# EAGLE design schematic (EAGLE 7.4.0)
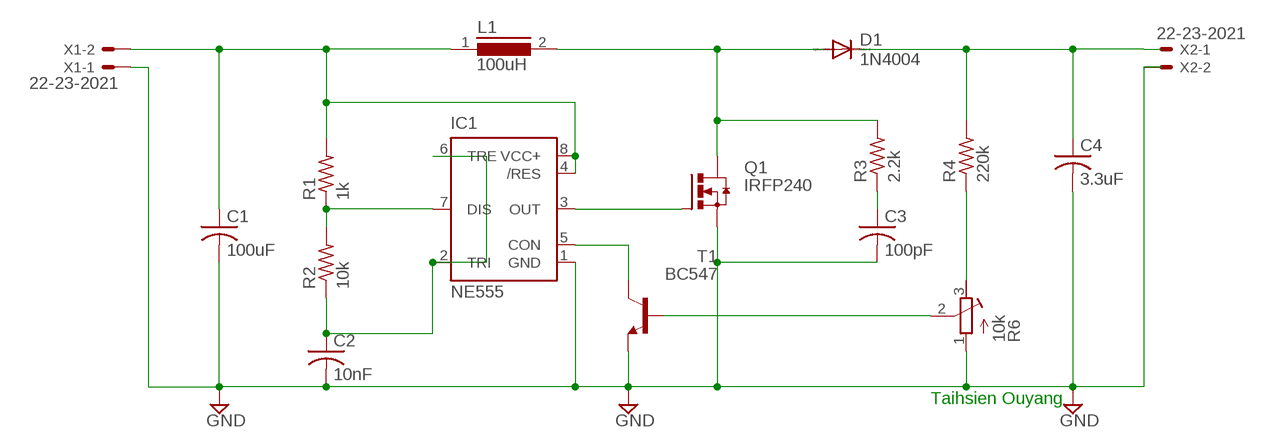
[diagram p0: schematic, sheet 1]

## Parts
C1  100uF  C-US050-025X075  [C050-025X075]
C2  10nF  C-US050-025X075  [C050-025X075]
C3  100pF  C-US050-025X075  [C050-025X075]
C4  3.3uF  C-US050-025X075  [C050-025X075]
D1  1N4004  [DO41-10]
IC1  NE555  [DIL-08]
L1  100uH  SFT1040  [SFT1040]
Q1  IRFP240  [TO247BV]
R1  1k  R-US_0207/7  [0207/7]
R2  10k  R-US_0207/7  [0207/7]
R3  2.2k  R-US_0207/7  [0207/7]
R4  220k  R-US_0207/7  [0207/7]
R6  10k  R-TRIMM3339P  [RTRIM3339P]
T1  BC547  [TO92]
X1  22-23-2021  [22-23-2021]
X2  22-23-2021  [22-23-2021]

## Nets
GND: C1.2 C2.2 C3.2 C4.2 IC1.1(GND) Q1.S R6.1(A) T1.1(E) X1.1 X2.2
N$1: IC1.7(DIS) R1.1 R2.2
N$2: C2.1 IC1.2(TRI) IC1.6(TRE) R2.1
N$5: D1.A L1.2 Q1.D R3.2
N$6: IC1.3(OUT) Q1.G
N$7: C4.1 D1.C R4.2 X2.1
N$8: R4.1 R6.3(E)
N$9: R6.2(S) T1.2(B)
N$10: C3.1 R3.1
N$13: IC1.5(CON) T1.3(C)
VCC+: C1.1 IC1.4(/RES) IC1.8(VCC+) L1.1 R1.2 X1.2

## Notes on the sheet
- Taihsien Ouyang

## Library data of the parts
C1-C4 = rcl:C-US: CAPACITOR, American symbol
D1 = diode:1N4004: DIODE general purpose rectifier, 1 A
IC1 = st-microelectronics:NE555: General purpose bipolar Timer; MF: Arrow Electronics; MPN: NE555N; OC_FARNELL: 1467742; OC_NEWARK: 89K1486
L1 = inductors:SFT1040: INDUCTOR
Q1 = transistor-power:IRFP240: HEXFET Power MosFet Source: http://www.irf.com/
R1-R4 = resistor:R-US_: RESISTOR, American symbol
R6 = resistor:R-TRIMM: Trimm resistor
T1 = transistor:BC547: NPN TRANSISTOR
X1 X2 = con-molex:22-23-2021: .100" (2.54mm) Center Header - 2 Pin; MF: MOLEX; MPN: 22-23-2021; OC_FARNELL: 1462926; OC_NEWARK: 25C3832

## Board
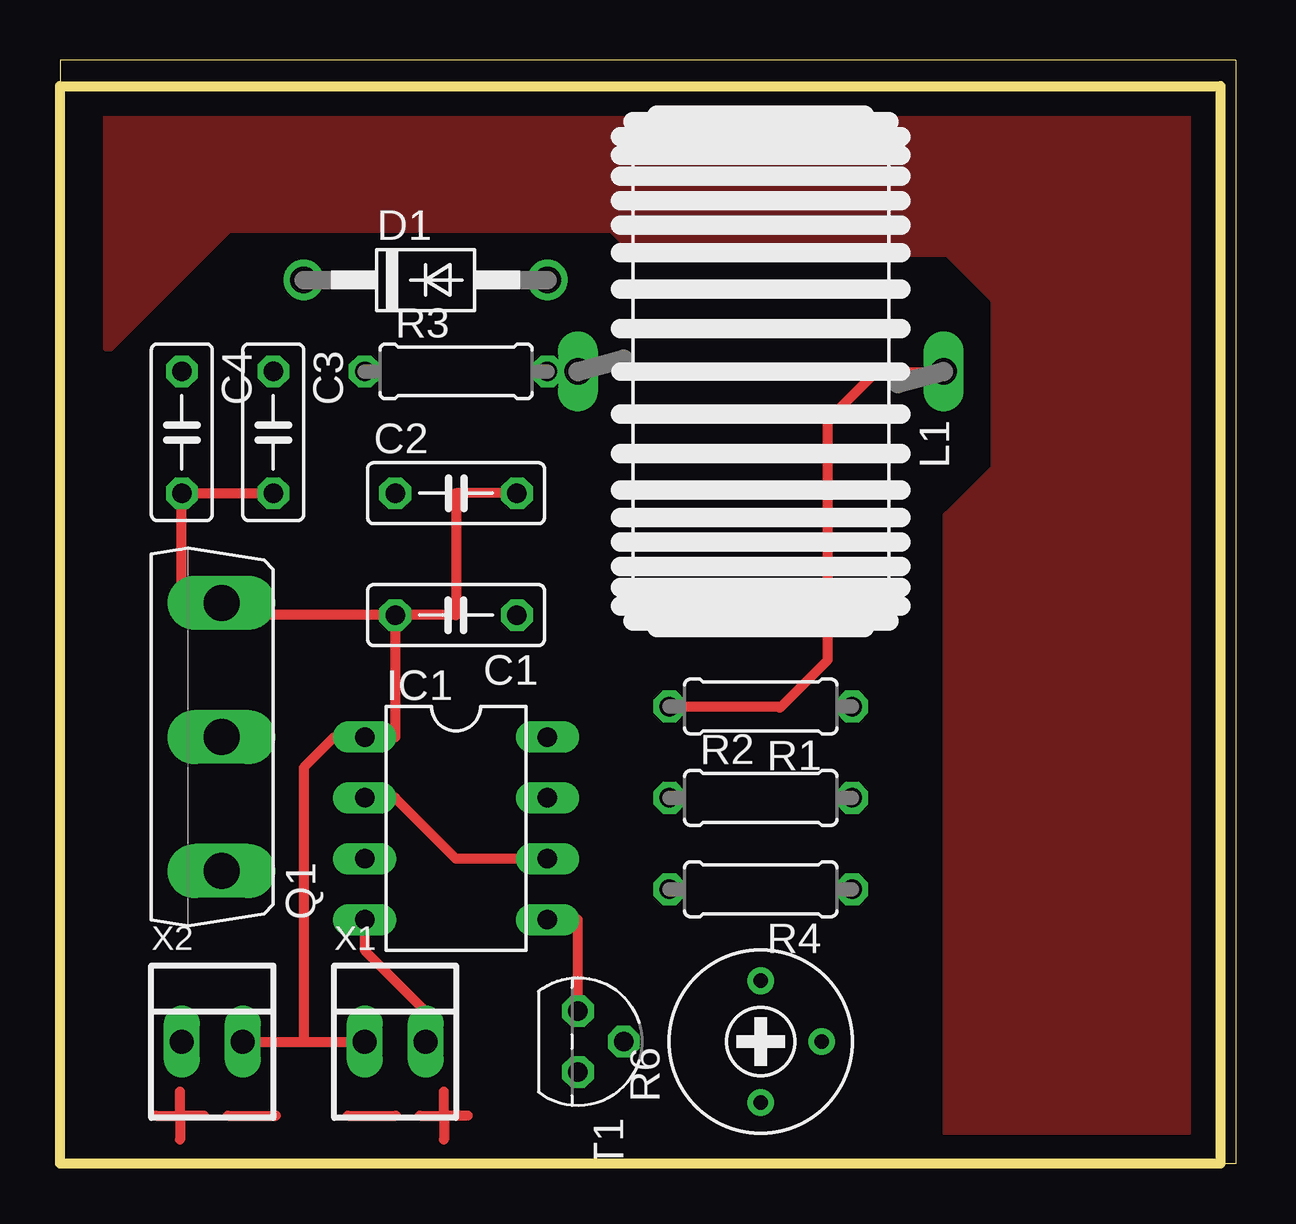
[diagram p1: board, top side]
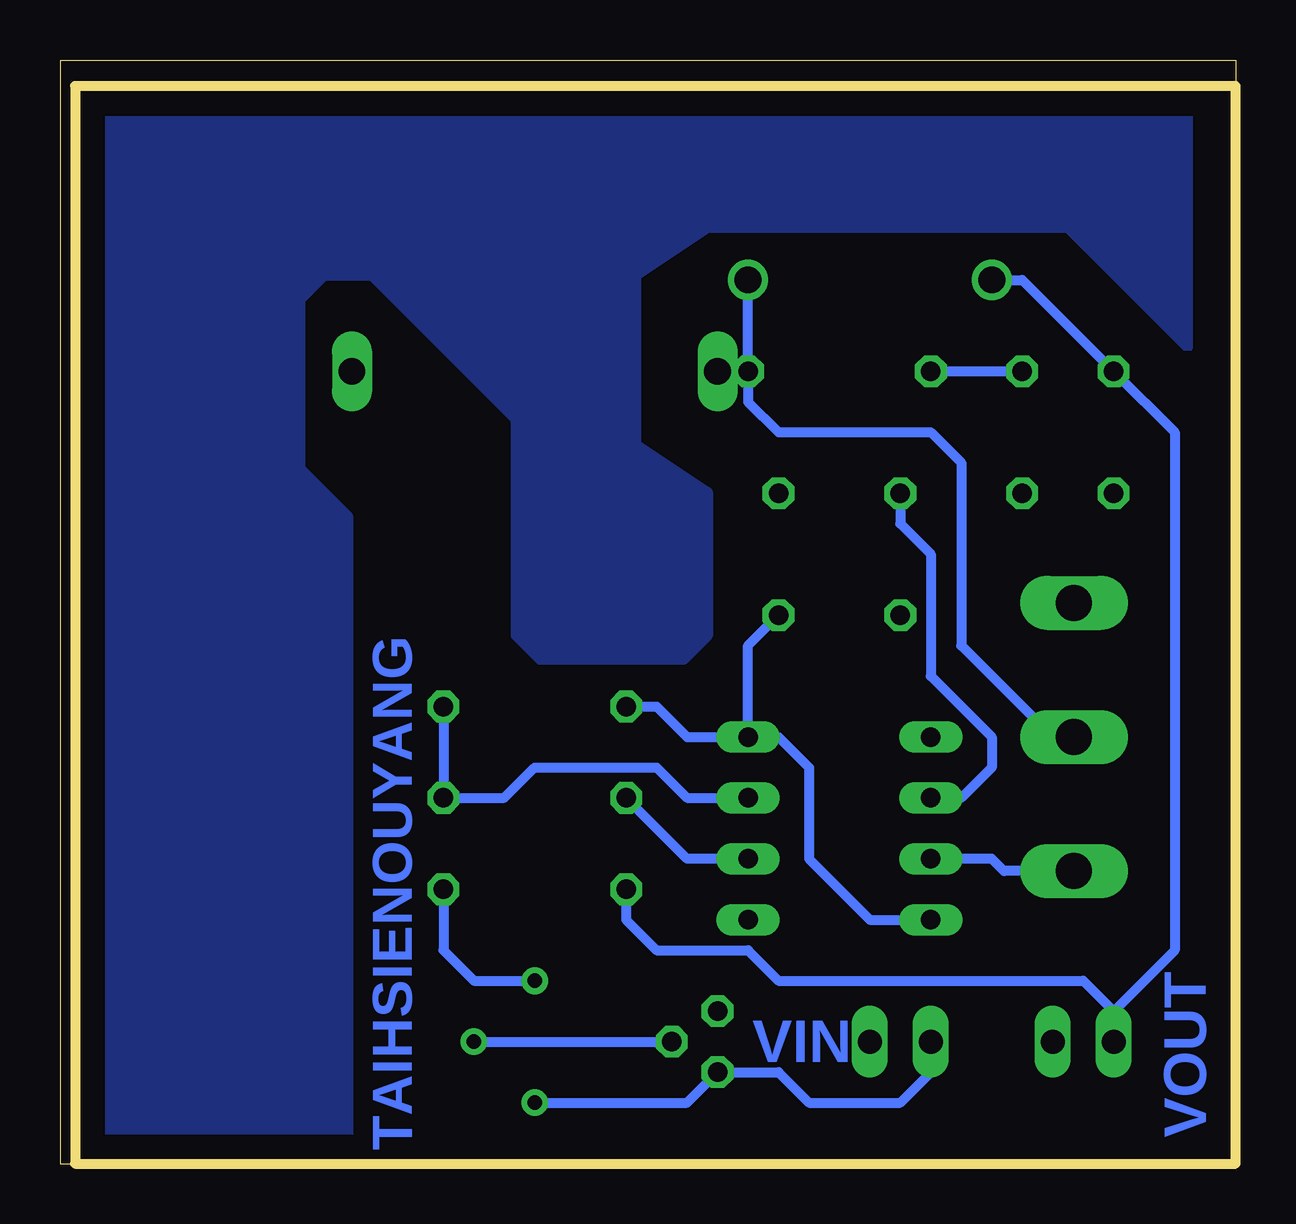
[diagram p2: board, bottom side, seen from below]

Size 49 x 46 mm. Coordinates in mm from the lower left corner, seen from the top.
Outline: 0,44.91 0,46 49,46 49,0 48.37,0
Outline: 0,44.91 48.37,44.91 48.37,0
Outline: 48.37,0 0,0 0,44.91
Copper layers (1*16): Top 0.035mm / dielectric 1.5mm / Bottom 0.035mm
Design rules "default": minimum track width 10mil, minimum drill 24mil, track to track 8mil, track to pad 8mil, pad to pad 8mil, via to via 8mil, smd to smd 8mil, copper to edge 40mil, drill to drill 8mil, minimum pad ring 10mil, minimum via ring 8mil, stop-mask expansion 4mil, vias tented up to drill 0mil, thermal gap 10mil

### Footprints (pad centres in the part's own frame; a part is rotated, then mirrored left to right if it is on the bottom)
C050-025X075 = drill 0.813 octagon: 1 -2.54,0; 2 2.54,0
DO41-10 = drill 1.118: A 5.08,0; C -5.08,0
DIL-08 = drill 0.813 long: 1 -3.81,-3.81; 2 -1.27,-3.81; 3 1.27,-3.81; 4 3.81,-3.81; 5 3.81,3.81; 6 1.27,3.81; 7 -1.27,3.81; 8 -3.81,3.81
SFT1040 = drill 1.118 long: 1 -7.62,0; 2 7.62,0
TO247BV = drill 1.499 long: D 0,-2.921; G -5.588,-2.921; S 5.588,-2.921
0207/7 = drill 0.813 octagon: 1 -3.81,0; 2 3.81,0
RTRIM3339P = drill 0.61: 1 -2.54,0; 2 0,-2.54; 3 2.54,0
TO92 = drill 0.813 octagon: 1 1.27,0; 2 0,1.905; 3 -1.27,0
22-23-2021 = drill 1 long: 1 -1.27,0; 2 1.27,0

### Placement (x,y rotation side)
C1  16.51,22.86 180 top
C2  16.51,27.94 0 top
C3  8.89,30.48 270 top
C4  5.08,30.48 270 top
D1  15.24,36.83 0 top
IC1  16.51,13.97 270 top
L1  29.21,33.02 180 top
Q1  3.81,17.78 90 top
R1  29.21,19.05 180 top
R2  29.21,15.24 0 top
R3  16.51,33.02 0 top
R4  29.21,11.43 180 top
R6  29.21,5.08 90 top
T1  21.59,5.08 270 top
X1  13.97,5.08 0 top
X2  6.35,5.08 0 top

### Tracks (layer width: path | path; a pad name or v marks a point on that pad's centre or on a via)
GND
  Top 0.406: C3.2 C4.2 5.08,23.37 Q1.S 6.73,22.86 C1.2 | C2.2 16.51,27.94 16.51,22.86 C1.2 | C1.2 13.97,17.78 IC1.1 11.43,17.78 10.16,16.51 10.16,5.08 | X2.2 10.16,5.08 | 10.16,5.08 X1.1
  Bottom 0.406: R6.1 22.86,2.54 T1.1 19.05,3.81 17.78,2.54 13.97,2.54 12.7,3.81 X1.1
N$1
  Bottom 0.406: R1.1 R2.2 30.48,15.24 29.21,16.51 24.13,16.51 22.86,15.24 IC1.7
N$2
  Top 0.406: IC1.6 16.51,12.7 13.97,15.24 IC1.2
  Bottom 0.406: C2.1 13.97,26.67 12.7,25.4 12.7,20.32 10.16,17.78 10.16,16.51 11.43,15.24 IC1.2 | IC1.6 22.86,12.7 R2.1
N$3
  pour Bottom: 2,43 2,34 7,39 22,39 25,37 25,30 22,28 22,22 23,21 29,21 30,22 30,31 35,36 36,37 38,37 39,36 39,29 37,27 37,1 47,1 47,44 2,44
N$4
  pour Top: 2,34 2,44 47,44 47,1 37,1 37,27 39,29 39,36 37,38 24,38 23,39 7,39
N$5
  Top 0.406: L1.2 R3.2
  Bottom 0.406: Q1.D 7.62,17.78 11.43,21.59 11.43,29.21 12.7,30.48 19.05,30.48 20.32,31.75 R3.2 D1.A
N$6
  Bottom 0.406: Q1.G 9.65,12.19 10.16,12.7 IC1.3
N$7
  Bottom 0.406: R4.2 25.4,10.16 24.13,8.89 20.32,8.89 19.05,7.62 6.35,7.62 5.08,6.35 | 5.08,6.35 X2.1 | 5.08,6.35 2.54,8.89 2.54,30.48 C4.1 8.89,36.83 D1.C
N$8
  Bottom 0.406: R4.1 33.02,8.89 31.75,7.62 R6.3
N$9
  Bottom 0.406: R6.2 T1.2
N$10
  Bottom 0.406: C3.1 R3.1
N$11
  Top 0.406: 4,2 5,2 | 6,2 5,2 | 5,2 5,1 | 5,2 5,3
N$12
  Top 0.406: 15,2 16,2 | 17,2 16,2 | 16,2 16,1 | 16,2 16,3
N$13
  Top 0.406: T1.3 21.59,10.16 IC1.5
N$14
  Top 0.406: 7,2 9,2
N$17
  Top 0.406: 12,2 14,2
VCC+
  Top 0.406: IC1.4 12.7,8.89 15.24,6.35 X1.2 | R1.2 30,19.05 30,19 32,21 32,31 34,33 36.81,33 L1.1
  Bottom 0.406: R1.2 24.13,19.05 22.86,17.78 IC1.8 | IC1.8 20.32,21.59 C1.1 | IC1.8 19.05,17.78 17.78,16.51 17.78,12.7 15.24,10.16 IC1.4

### Text on the board
Bottom: TAIHSIENOUYANG | VOUT | VIN